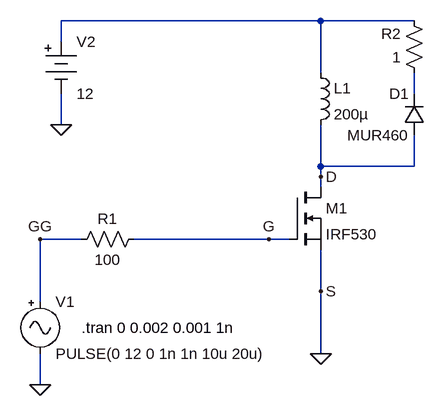
[diagram p0: schematic Ejercicio1.asc]
Ejercicio1.asc, the LTspice schematic file:
Version 4
SHEET 1 880 680
WIRE 256 0 -144 0
WIRE 400 0 256 0
WIRE -144 32 -144 0
WIRE 256 80 256 0
WIRE 400 112 400 80
WIRE -144 160 -144 112
WIRE 256 224 256 160
WIRE 400 224 400 176
WIRE 400 224 256 224
WIRE 256 240 256 224
WIRE 256 256 256 240
WIRE -112 336 -176 336
WIRE 176 336 -32 336
WIRE 208 336 176 336
WIRE 256 416 256 352
WIRE -176 432 -176 336
WIRE 256 512 256 416
WIRE -176 560 -176 512
FLAG -176 560 0
FLAG 256 512 0
FLAG -144 160 0
FLAG 176 336 G
FLAG 256 416 S
FLAG 256 240 D
FLAG -176 336 GG
SYMBOL ind 240 64 R0
SYMATTR InstName L1
SYMATTR Value 200µ
SYMBOL diode 416 176 R180
WINDOW 0 24 64 Left 2
WINDOW 3 24 0 Left 2
SYMATTR InstName D1
SYMATTR Value MUR460
SYMBOL res -16 320 R90
WINDOW 0 0 56 VBottom 2
WINDOW 3 32 56 VTop 2
SYMATTR InstName R1
SYMATTR Value 100
SYMBOL res 416 96 R180
WINDOW 0 36 76 Left 2
WINDOW 3 36 40 Left 2
SYMATTR InstName R2
SYMATTR Value 1
SYMBOL Misc\\battery -144 16 R0
WINDOW 123 0 0 Left 0
WINDOW 39 0 0 Left 0
SYMATTR InstName V2
SYMATTR Value 12
SYMBOL Misc\\signal -176 416 R0
WINDOW 123 0 0 Left 0
WINDOW 39 0 0 Left 0
SYMATTR InstName V1
SYMATTR Value PULSE(0 12 0 1n 1n 10u 20u)
SYMBOL nmos 208 256 R0
SYMATTR InstName M1
SYMATTR Value IRF530
TEXT -112 472 Left 2 !.tran 0 0.002 0.001 1n

The netlist it stands for:
* Ejercicio1.asc
L1 N001 D 200µ
D1 D N002 MUR460
R1 G GG 100
R2 N002 N001 1
V2 N001 0 12
V1 GG 0 PULSE(0 12 0 1n 1n 10u 20u)
M1 D G 0 0 IRF530
.model D D
.lib standard.dio
.model NMOS NMOS
.model PMOS PMOS
.lib standard.mos
.tran 0 0.002 0.001 1n
.backanno
.end

* Results of the author's LTspice run, read from the files saved beside the schematic
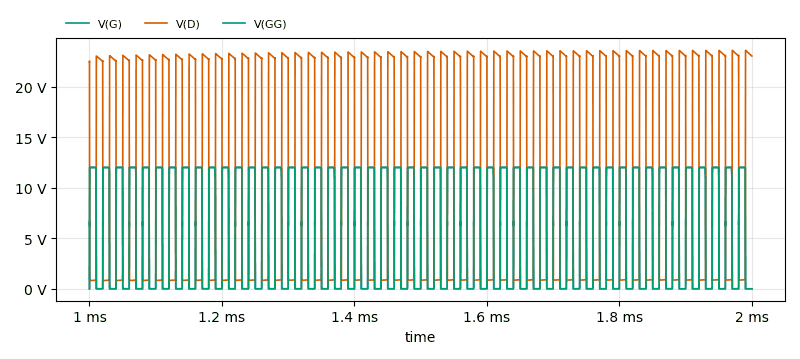
[diagram p1: Transient Analysis of Ejercicio1.asc, plotted from the saved traces]
* Transient Analysis, 1 run:
*   V(G): min -1.641 mV, max 12 V, average 6.001 V, rms 8.409 V, last -1.569 mV
*   V(D): min 808.7 mV, max 23.58 V, average 11.88 V, rms 16.24 V, last 23.02 V
*   V(GG): min 0 V, max 12 V, average 6.001 V, rms 8.486 V, last 0 V